# EAGLE design jamma (EAGLE 7.3.0)
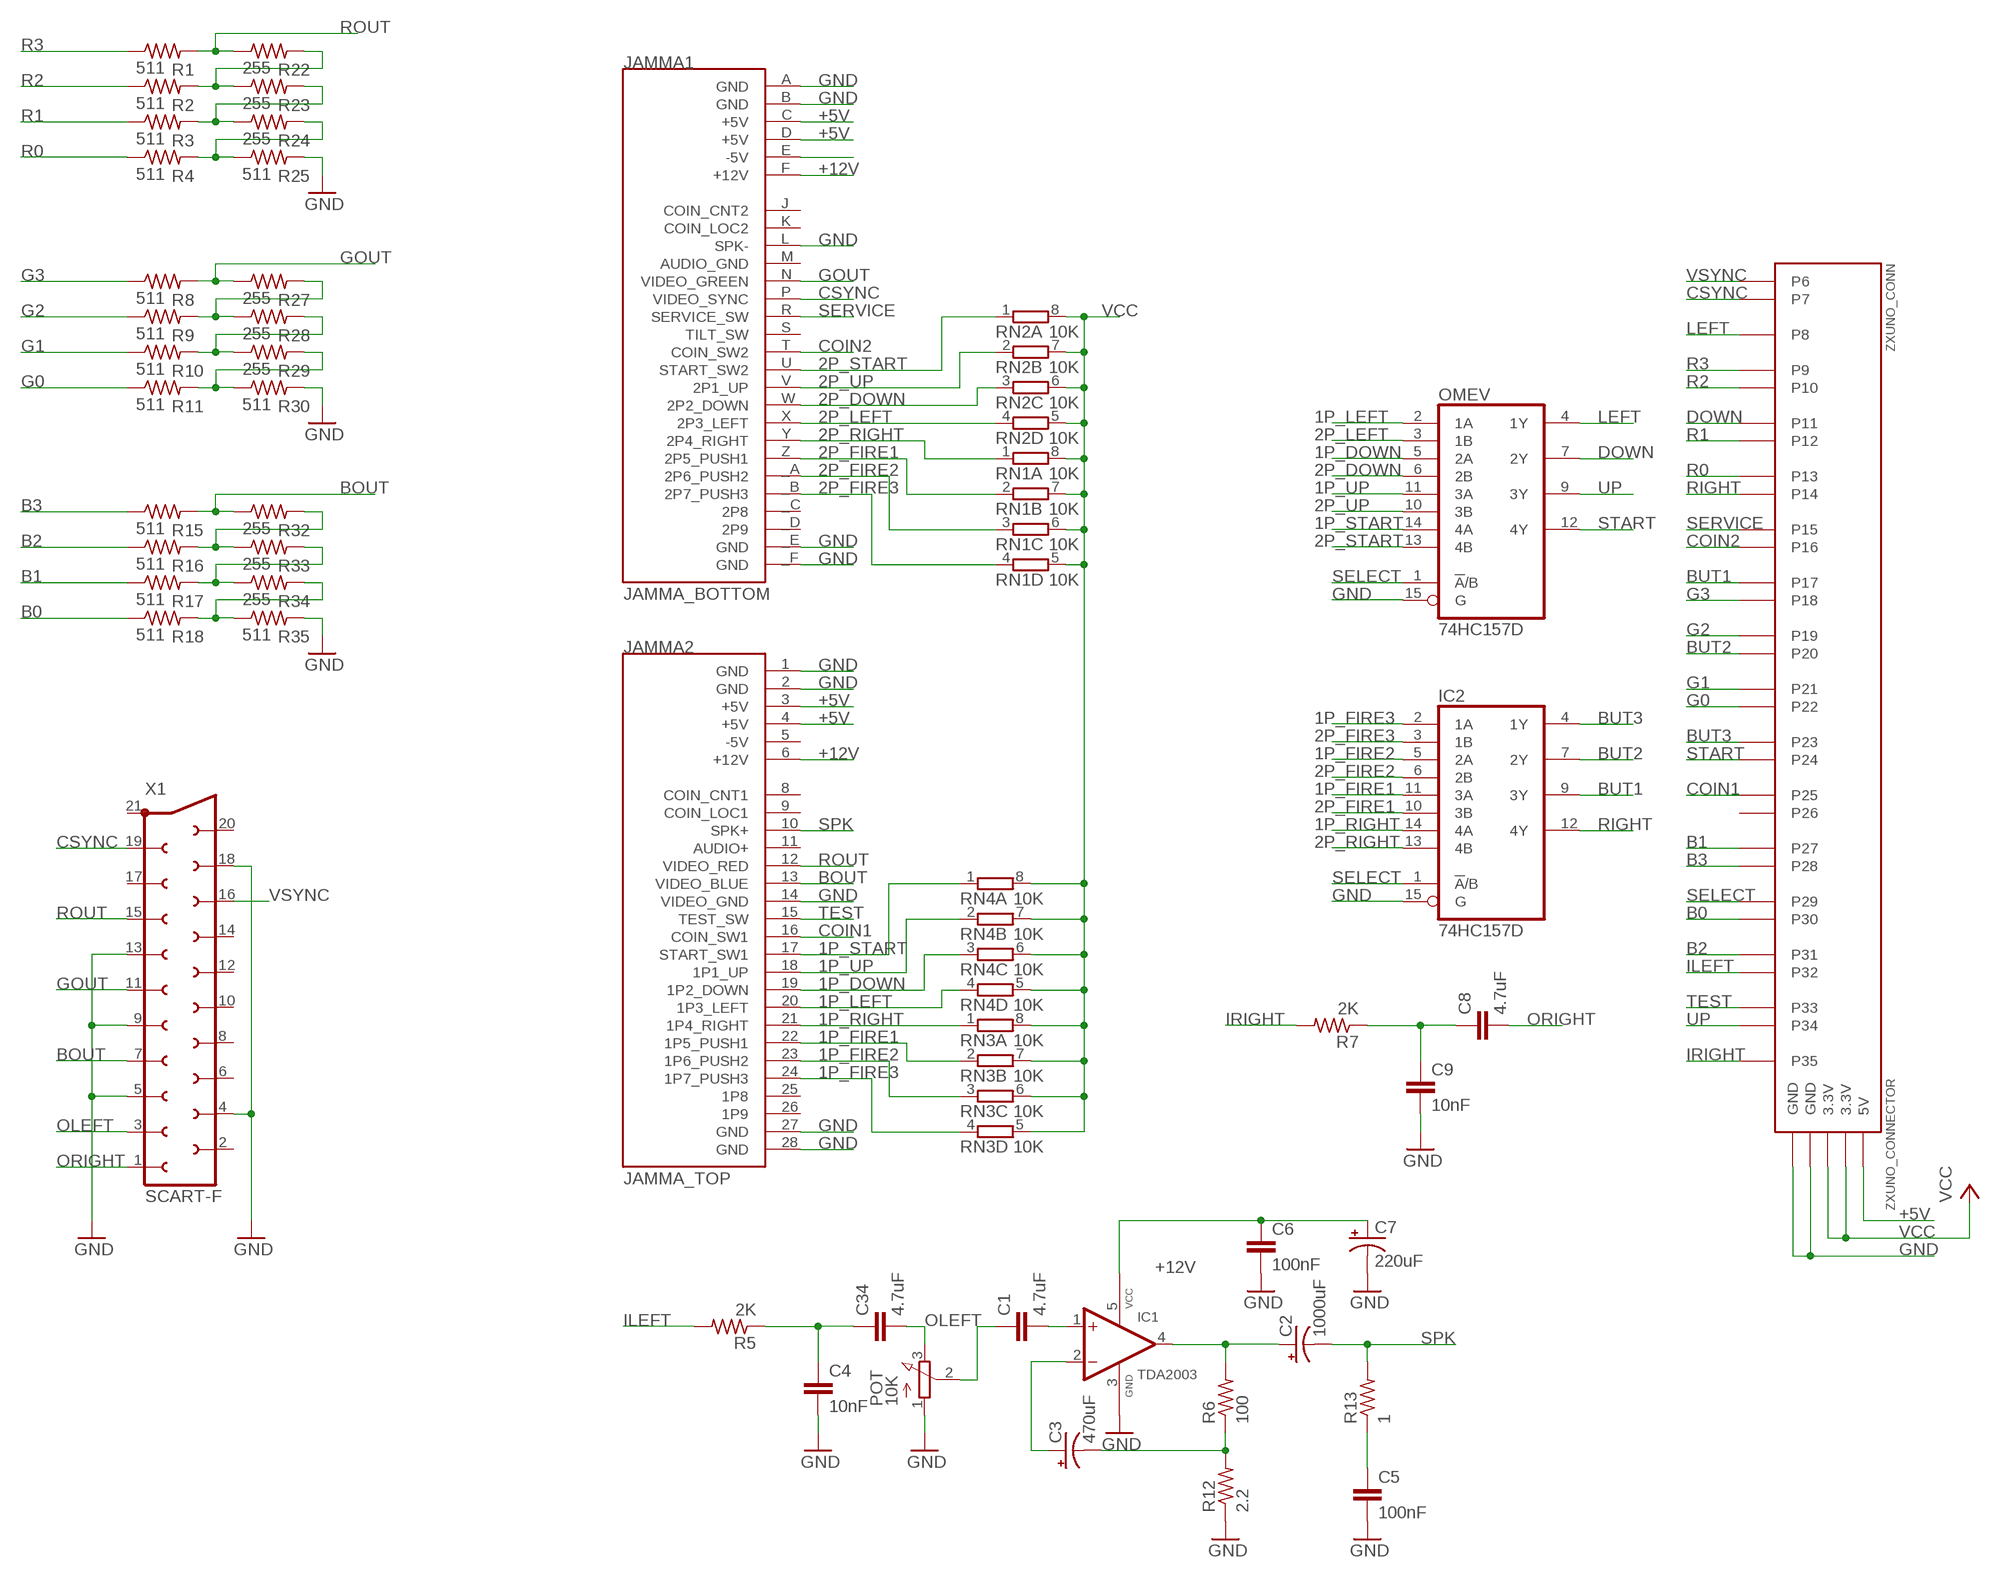
[diagram p0: schematic, sheet 1]

## Parts
C1  4.7uF  C-EUC0805  [C0805]
C2  1000uF  CPOL-USE5-13  [E5-13]
C3  470uF  CPOL-USE5-10.5  [E5-10,5]
C4  10nF  C-EUC0805  [C0805]
C5  100nF  C-EUC0805K  [C0805K]
C6  100nF  C-EUC0805K  [C0805K]
C7  220uF  CPOL-USE5-10.5  [E5-10,5]
C8  4.7uF  C-EUC0805  [C0805]
C9  10nF  C-EUC0805  [C0805]
C34  4.7uF  C-EUC0805  [C0805]
IC1  TDA2003  [PENTAWATT-V]
IC2  74HC157D  [SO16]
JAMMA1  JAMMA_BOTTOM  [JAMMA_BOTTOM]
JAMMA2  JAMMA_TOP  [JAMMA_TOP]
OMEV  74HC157D  [SO16]
POT  10K  POT  [POT]
R1  511  R-US_R0805  [R0805]
R2  511  R-US_R0805  [R0805]
R3  511  R-US_R0805  [R0805]
R4  511  R-US_R0805  [R0805]
R5  2K  R-US_M0805  [M0805]
R6  100  R-US_R0805  [R0805]
R7  2K  R-US_M0805  [M0805]
R8  511  R-US_R0805  [R0805]
R9  511  R-US_R0805  [R0805]
R10  511  R-US_R0805  [R0805]
R11  511  R-US_R0805  [R0805]
R12  2.2  R-US_R0805  [R0805]
R13  1  R-US_R0805  [R0805]
R15  511  R-US_R0805  [R0805]
R16  511  R-US_R0805  [R0805]
R17  511  R-US_R0805  [R0805]
R18  511  R-US_R0805  [R0805]
R22  255  R-US_R0805  [R0805]
R23  255  R-US_R0805  [R0805]
R24  255  R-US_R0805  [R0805]
R25  511  R-US_R0805  [R0805]
R27  255  R-US_R0805  [R0805]
R28  255  R-US_R0805  [R0805]
R29  255  R-US_R0805  [R0805]
R30  511  R-US_R0805  [R0805]
R32  255  R-US_R0805  [R0805]
R33  255  R-US_R0805  [R0805]
R34  255  R-US_R0805  [R0805]
R35  511  R-US_R0805  [R0805]
RN1  10K  4R-N0603-ARC  [0603-ARC]
RN2  10K  4R-N0603-ARC  [0603-ARC]
RN3  10K  4R-N0603-ARC  [0603-ARC]
RN4  10K  4R-N0603-ARC  [0603-ARC]
X1  SCART-F  [SCART-F]
ZXUNO_CONN  ZXUNO_CONNECTOR  [ZXUNO_CONNECTOR]

## Nets
1P_DOWN: JAMMA2.19(1P2_DOWN) OMEV.5(2A) RN4.3
1P_FIRE1: IC2.11(3A) JAMMA2.22(1P5_PUSH1) RN3.2
1P_FIRE2: IC2.5(2A) JAMMA2.23(1P6_PUSH2) RN3.3
1P_FIRE3: IC2.2(1A) JAMMA2.24(1P7_PUSH3) RN3.4
1P_LEFT: JAMMA2.20(1P3_LEFT) OMEV.2(1A) RN4.4
1P_RIGHT: IC2.14(4A) JAMMA2.21(1P4_RIGHT) RN3.1
1P_START: JAMMA2.17(START_SW1) OMEV.14(4A) RN4.1
1P_UP: JAMMA2.18(1P1_UP) OMEV.11(3A) RN4.2
2P_DOWN: JAMMA1.W(2P2_DOWN) OMEV.6(2B) RN2.3
2P_FIRE1: IC2.10(3B) JAMMA1.Z(2P5_PUSH1) RN1.2
2P_FIRE2: IC2.6(2B) JAMMA1._A(2P6_PUSH2) RN1.3
2P_FIRE3: IC2.3(1B) JAMMA1._B(2P7_PUSH3) RN1.4
2P_LEFT: JAMMA1.X(2P3_LEFT) OMEV.3(1B) RN2.4
2P_RIGHT: IC2.13(4B) JAMMA1.Y(2P4_RIGHT) RN1.1
2P_START: JAMMA1.U(START_SW2) OMEV.13(4B) RN2.1
2P_UP: JAMMA1.V(2P1_UP) OMEV.10(3B) RN2.2
+5V [power]: JAMMA1.C(+5V) JAMMA1.D(+5V) JAMMA2.3(+5V) JAMMA2.4(+5V) ZXUNO_CONN.5V
+12V: C6.1 C7.+ IC1.5(VCC) JAMMA1.F(+12V) JAMMA2.6(+12V)
B0: R18.1 ZXUNO_CONN.P30
B1: R17.1 ZXUNO_CONN.P27
B2: R16.1 ZXUNO_CONN.P31
B3: R15.1 ZXUNO_CONN.P28
BOUT: JAMMA2.13(VIDEO_BLUE) R15.2 R32.1 X1.7
BUT1: IC2.9(3Y) ZXUNO_CONN.P17
BUT2: IC2.7(2Y) ZXUNO_CONN.P20
BUT3: IC2.4(1Y) ZXUNO_CONN.P23
COIN1: JAMMA2.16(COIN_SW1) ZXUNO_CONN.P25
COIN2: JAMMA1.T(COIN_SW2) ZXUNO_CONN.P16
CSYNC: JAMMA1.P(VIDEO_SYNC) X1.19 ZXUNO_CONN.P7
DOWN: OMEV.7(2Y) ZXUNO_CONN.P11
G0: R11.1 ZXUNO_CONN.P22
G1: R10.1 ZXUNO_CONN.P21
G2: R9.1 ZXUNO_CONN.P19
G3: R8.1 ZXUNO_CONN.P18
GND [power]: C4.2 C5.2 C6.2 C7.- C9.2 IC1.3(GND) IC2.15(G) JAMMA1._E(GND) JAMMA1._F(GND) JAMMA1.A(GND) JAMMA1.B(GND) JAMMA1.L(SPK-) JAMMA2.1(GND) JAMMA2.2(GND) JAMMA2.14(VIDEO_GND) JAMMA2.27(GND) JAMMA2.28(GND) OMEV.15(G) POT.1(A) R12.1 R25.2 R30.2 R35.2 X1.4 X1.5 X1.9 X1.13 X1.18 ZXUNO_CONN.GND@1(GND) ZXUNO_CONN.GND@2(GND)
GOUT: JAMMA1.N(VIDEO_GREEN) R8.2 R27.1 X1.11
ILEFT: R5.2 ZXUNO_CONN.P32
IRIGHT: R7.2 ZXUNO_CONN.P35
LEFT: OMEV.4(1Y) ZXUNO_CONN.P8
N$1: C8.1 C9.1 R7.1
N$3: C1.2 IC1.1(+IN)
N$4: C1.1 POT.2(S)
N$5: C3.+ IC1.2(-IN)
N$6: JAMMA1.E(-5V)
N$7: C3.- R6.1 R12.2
N$8: R9.2 R27.2 R28.1
N$9: C2.+ IC1.4(OUT) R6.2
N$11: C4.1 C34.1 R5.1
N$12: C5.1 R13.1
N$15: R2.2 R22.2 R23.1
N$19: R3.2 R23.2 R24.1
N$21: R4.2 R24.2 R25.1
N$25: R11.2 R29.2 R30.1
N$27: R10.2 R28.2 R29.1
N$42: R16.2 R32.2 R33.1
N$43: R17.2 R33.2 R34.1
N$44: R18.2 R34.2 R35.1
OLEFT: C34.2 POT.3(E) X1.3
ORIGHT: C8.2 X1.1
R0: R4.1 ZXUNO_CONN.P13
R1: R3.1 ZXUNO_CONN.P12
R2: R2.1 ZXUNO_CONN.P10
R3: R1.1 ZXUNO_CONN.P9
RIGHT: IC2.12(4Y) ZXUNO_CONN.P14
ROUT: JAMMA2.12(VIDEO_RED) R1.2 R22.1 X1.15
SELECT: IC2.1(!A!/B) OMEV.1(!A!/B) ZXUNO_CONN.P29
SERVICE: JAMMA1.R(SERVICE_SW) ZXUNO_CONN.P15
SPK: C2.- JAMMA2.10(SPK+) R13.2
START: OMEV.12(4Y) ZXUNO_CONN.P24
TEST: JAMMA2.15(TEST_SW) ZXUNO_CONN.P33
UP: OMEV.9(3Y) ZXUNO_CONN.P34
VCC: RN1.5 RN1.6 RN1.7 RN1.8 RN2.5 RN2.6 RN2.7 RN2.8 RN3.5 RN3.6 RN3.7 RN3.8 RN4.5 RN4.6 RN4.7 RN4.8 ZXUNO_CONN.3.3V@1(3.3V) ZXUNO_CONN.3.3V@2(3.3V)
VSYNC: X1.16 ZXUNO_CONN.P6
Unconnected: JAMMA1._C(2P8) JAMMA1._D(2P9) JAMMA1.J(COIN_CNT2) JAMMA1.K(COIN_LOC2) JAMMA1.M(AUDIO_GND) JAMMA1.S(TILT_SW) JAMMA2.8(COIN_CNT1) JAMMA2.9(COIN_LOC1) JAMMA2.11(AUDIO+) JAMMA2.25(1P8) JAMMA2.26(1P9) X1.2 X1.6 X1.8 X1.10 X1.12 X1.14 X1.17 X1.20 X1.21 ZXUNO_CONN.P26

## Power pins joined to a net without a drawn wire
-5V: JAMMA2.5(-5V)
GND: IC2.8(GND) OMEV.8(GND)
VCC: IC2.16(VCC) OMEV.16(VCC)

## Library data of the parts
C1 C4-C6 C8 C9 C34 = rcl:C-EU: CAPACITOR, European symbol
C2 C3 C7 = rcl:CPOL-US: POLARIZED CAPACITOR, American symbol
IC1 = tda2003:TDA2003: Car Radio Audio Amplifier
IC2 OMEV = 74xx-eu:74*157: Quadruple 2-line to 1-line data SELECTOR/MULTIPLEXER
JAMMA1 = JAMMA:JAMMA_BOTTOM: JAMMA Connector Bottom Solder side for these card-edge connenctors HIROSE CR7E-56DA-3.96E HIROSE CR7E-56DB-3.96E KEL 1168-056-009
JAMMA2 = JAMMA:JAMMA_TOP: JAMMA Connector Top Parts side for these card-edge connenctors HIROSE CR7E-56DA-3.96E HIROSE CR7E-56DB-3.96E KEL 1168-056-009
POT = tda2003:POT
R1-R13 R15-R18 R22-R25 R27-R30 R32-R35 = rcl:R-US_: RESISTOR, American symbol
RN1-RN4 = resistor-dil:4R-N: Array Chip Resistor Source: RS Component / Phycomp; OC_FARNELL: unknown; OC_NEWARK: unknown
X1 = con-hirschmann:SCART-F: TV SCART CONNECTOR; OC_FARNELL: unknown; OC_NEWARK: unknown
ZXUNO_CONN = zxuno:ZXUNO_CONNECTOR

## Net classes
0 default: clearance 0.205 mm
1 power: width 0.305 mm, clearance 0.178 mm to class 0, clearance 0.229 mm

## Board
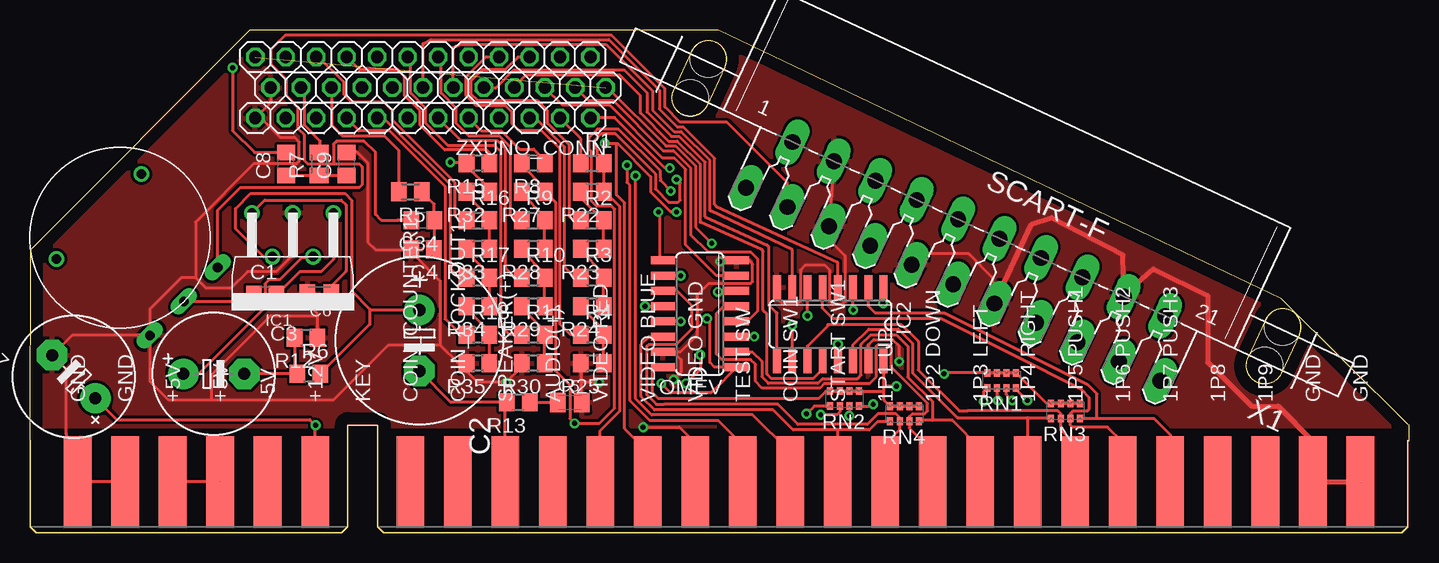
[diagram p1: board, top side]
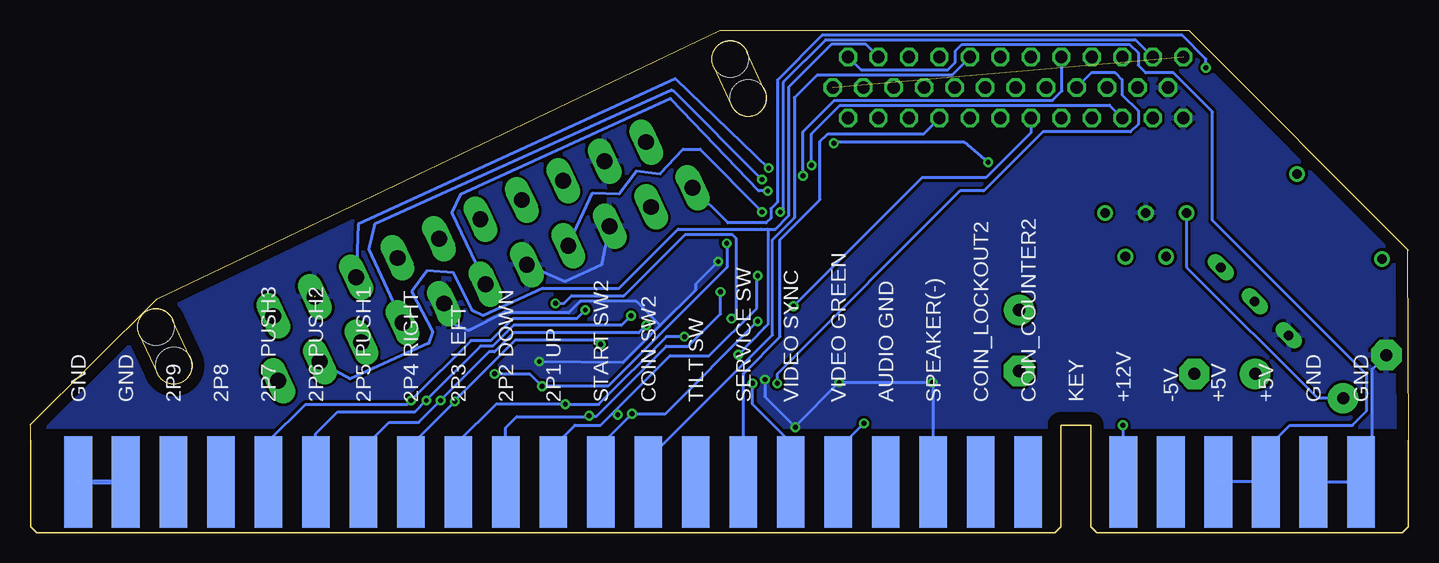
[diagram p2: board, bottom side, seen from below]

Size 114.92 x 41.89 mm. Coordinates in mm from the lower left corner, seen from the top.
Outline: 114.9,8.99 104.3,19.5 57.39,41.89 18.33,41.88 0.02,23.54
Outline: 0,7.61 0.06,23.54
Outline: 114.92,8.98 114.92,7.63
Copper layers (1*16): Top 0.035mm / dielectric 1.5mm / Bottom 0.035mm
Design rules "default": minimum track width 10mil, minimum drill 24mil, track to track 8mil, track to pad 8mil, pad to pad 8mil, via to via 8mil, smd to smd 8mil, copper to edge 40mil, drill to drill 8mil, minimum pad ring 10mil, minimum via ring 8mil, stop-mask expansion 4mil, vias tented up to drill 0mil, thermal gap 10mil

### Footprints (pad centres in the part's own frame; a part is rotated, then mirrored left to right if it is on the bottom)
C0805 = smd 1.3 x 1.5: 1 -0.95,0; 2 0.95,0
E5-13 = drill 1.016 pad 2.54: + -2.54,0 | drill 1.016 pad 2.54 octagon: - 2.54,0
E5-10,5 = drill 1.016 pad 2.54: + -2.54,0 | drill 1.016 pad 2.54 octagon: - 2.54,0
C0805K = smd 1.3 x 1.6: 1 -1,0; 2 1,0
PENTAWATT-V = drill 0.8: 1 -3.4,-3.81; 2 -1.7,-0.16; 3 0,-3.81; 4 1.7,-0.16; 5 3.4,-3.81
SO16 = smd 0.66 x 2.032: 1 -4.445,-3.073; 2 -3.175,-3.073; 3 -1.905,-3.073; 4 -0.635,-3.073; 5 0.635,-3.073; 6 1.905,-3.073; 7 3.175,-3.073; 8 4.445,-3.073; 9 4.445,3.073; 10 3.175,3.073; 11 1.905,3.073; 12 0.635,3.073; 13 -0.635,3.073; 14 -1.905,3.073; 15 -3.175,3.073; 16 -4.445,3.073
JAMMA_BOTTOM = smd 2.3 x 7.62 bottom: _A 33.66,-1.27; _B 37.62,-1.27; _C 41.58,-1.27; _D 45.54,-1.27; _E 49.5,-1.27; _F 53.46,-1.27; A -53.46,-1.27; B -49.5,-1.27; C -45.54,-1.27; D -41.58,-1.27; E -37.62,-1.27; F -33.66,-1.27; J -25.74,-1.27; K -21.78,-1.27; L -17.82,-1.27; M -13.86,-1.27; N -9.9,-1.27; P -5.94,-1.27; R -1.98,-1.27; S 1.98,-1.27; T 5.94,-1.27; U 9.9,-1.27; V 13.86,-1.27; W 17.82,-1.27; X 21.78,-1.27; Y 25.74,-1.27; Z 29.7,-1.27
JAMMA_TOP = smd 2.3 x 7.62: 1 -53.46,-1.27; 2 -49.5,-1.27; 3 -45.54,-1.27; 4 -41.58,-1.27; 5 -37.62,-1.27; 6 -33.66,-1.27; 8 -25.74,-1.27; 9 -21.78,-1.27; 10 -17.82,-1.27; 11 -13.86,-1.27; 12 -9.9,-1.27; 13 -5.94,-1.27; 14 -1.98,-1.27; 15 1.98,-1.27; 16 5.94,-1.27; 17 9.9,-1.27; 18 13.86,-1.27; 19 17.82,-1.27; 20 21.78,-1.27; 21 25.74,-1.27; 22 29.7,-1.27; 23 33.66,-1.27; 24 37.62,-1.27; 25 41.58,-1.27; 26 45.54,-1.27; 27 49.5,-1.27; 28 53.46,-1.27
POT = drill 0.8 long: 1 -4,0; 2 0,0; 3 4,0 | drill 0.8: P$4 -5,10; P$5 5,10
R0805 = smd 1.3 x 1.5: 1 -0.95,0; 2 0.95,0
M0805 = smd 1.3 x 1.6: 1 -0.95,0; 2 0.95,0
0603-ARC = smd 0.5 x 0.65: 1 -1.2,-0.625; 2 -0.4,-0.625; 3 0.4,-0.625; 4 1.2,-0.625; 5 1.2,0.625; 6 0.4,0.625; 7 -0.4,0.625; 8 -1.2,0.625
SCART-F = drill 1.321 long: 1 19.05,5.08; 2 17.145,0; 3 15.24,5.08; 4 13.335,0; 5 11.43,5.08; 6 9.525,0; 7 7.62,5.08; 8 5.715,0; 9 3.81,5.08; 10 1.905,0; 11 0,5.08; 12 -1.905,0; 13 -3.81,5.08; 14 -5.715,0; 15 -7.62,5.08; 16 -9.525,0; 17 -11.43,5.08; 18 -13.335,0; 19 -15.24,5.08; 20 -17.145,0; 21 -19.05,5.08 | hole 3.023: 26.416,0.254; 26.416,-3.302; -26.416,0.254; -26.416,-3.302
ZXUNO_CONNECTOR = drill 1.016 octagon: 3.3V@1 -13.97,0; 3.3V@2 15.24,-2.54; 5V -12.7,-2.54; GND@1 15.24,2.54; GND@2 13.97,0; NC@1 12.7,2.54; P6 -12.7,2.54; P7 -10.16,-2.54; P8 -11.43,0; P9 -10.16,2.54; P10 -7.62,-2.54; P11 -8.89,0; P12 -7.62,2.54; P13 -5.08,-2.54; P14 -6.35,0; P15 -5.08,2.54; P16 -2.54,-2.54; P17 -3.81,0; P18 -2.54,2.54; P19 0,-2.54; P20 -1.27,0; P21 0,2.54; P22 2.54,-2.54; P23 1.27,0; P24 2.54,2.54; P25 5.08,-2.54; P26 3.81,0; P27 5.08,2.54; P28 7.62,-2.54; P29 6.35,0; P30 7.62,2.54; P31 10.16,-2.54; P32 8.89,0; P33 10.16,2.54; P34 12.7,-2.54; P35 11.43,0

### Placement (x,y rotation side)
C1  19.6,19.82 0 top
C2  32.46,16.01 270 top
C3  15.32,13.23 0 top
C4  32.73,23.63 180 top
C5  45,10.85 0 top
C6  24.13,19.9 180 top
C7  3.65,13 135 top
C8  21.34,30.73 90 top
C9  26.42,30.73 90 top
C34  32.74,26.02 180 top
IC1  21.9,22.84 180 top
IC2  66.72,17.37 180 top
JAMMA1  57.44,5.5 0 top
JAMMA2  57.44,5.5 0 top
OMEV  55.84,18.24 90 top
POT  12.82,19.27 45 top
R1  46.87,30.78 0 top
R2  46.87,26.02 0 top
R3  46.87,21.26 0 top
R4  46.87,16.49 0 top
R5  31.71,28.4 180 top
R6  23.25,13.23 0 top
R7  24.11,30.73 90 top
R8  41.95,30.78 180 top
R9  41.95,26.02 0 top
R10  41.95,21.26 0 top
R11  41.95,16.49 0 top
R12  23.01,16.25 180 top
R13  40.72,10.85 180 top
R15  37.35,30.78 180 top
R16  37.35,26.02 0 top
R17  37.35,21.26 0 top
R18  37.35,16.49 0 top
R22  46.87,28.4 180 top
R23  46.87,23.64 180 top
R24  46.87,18.88 180 top
R25  46.87,14.11 180 top
R27  41.95,28.4 180 top
R28  41.95,23.64 180 top
R29  41.95,18.88 180 top
R30  41.95,14.11 180 top
R32  37.35,28.4 180 top
R33  37.35,23.64 180 top
R34  37.35,18.88 180 top
R35  37.35,14.11 180 top
RN1  81,12.68 0 top
RN2  67.91,11.18 0 top
RN3  86.32,10.14 0 top
RN4  72.91,9.91 0 top
X1  79.1,25.31 155 top
ZXUNO_CONN  34.02,37.09 180 top

### Tracks (layer width: path | path; a pad name or v marks a point on that pad's centre or on a via)
1P_DOWN
  Top 0.254: JAMMA2.19 75.26,6.76 73.31,8.71 RN4.3 73.31,9.67 73.54,9.91 74.58,9.91 74.81,10.14 74.81,10.78 71.75,13.84 71.75,15.54 71.59,15.69 70.72,15.69 70.56,15.54 70.56,13 70.01,12.45 66.24,12.45 65.84,12.05 61.03,12.05 60.48,12.6 60.48,14.03 60.08,14.42 57.7,14.42 57.23,14.9 57.23,18.27 57.83,18.88 OMEV.5
1P_FIRE1
  Top 0.254: JAMMA2.22 87.14,7.35 85.93,8.56 RN3.2 85.92,9.91 85.69,10.14 78.15,10.14 78.14,10.14 77.47,10.14 74.05,13.55 74.05,15.93 72.62,17.36 66.51,17.36 66.51,17.24 64.81,15.54 IC2.11
1P_FIRE2
  Top 0.254: JAMMA2.23 91.1,7.51 89.82,8.8 86.88,8.8 86.72,8.95 RN3.3 86.72,9.91 86.96,10.14 88.15,10.14 88.31,10.3 88.31,11.26 87.67,11.89 75.92,17.84 66.96,17.84 66.08,18.72 IC2.5
1P_FIRE3
  Top 0.254: JAMMA2.24 95.05,5.5 95.05,8.16 93.69,9.52 RN3.4 88.93,9.52 88.94,9.51 88.94,11.57 88.15,12.37 76.24,18.32 70.45,18.32 69.89,18.88 IC2.2
1P_LEFT
  Top 0.254: JAMMA2.20 79.22,7.01 76.88,9.35 75.21,9.35 | 75.21,9.35 74.18,9.35 RN4.4 | OMEV.2 60.21,15.07 61,14.27 61,13 61.56,12.45 65.69,12.45 66.08,12.84 68.98,12.84 69.29,13.15 69.29,15.69 70.08,16.49 72.23,16.49 73.18,15.54 73.18,12.97 75.21,10.94 75.21,9.35
1P_RIGHT
  Top 0.254: IC2.14 68.62,15.38 68.62,15.66 69.93,16.96 72.39,16.96 73.58,15.77 73.58,13.31 77.31,9.58 77.31,9.59 83.15,9.59 | 83.15,9.59 85.05,9.59 RN3.1 | JAMMA2.21 83.18,9.56 83.15,9.59
1P_START
  Top 0.254: JAMMA2.17 67.34,8.49 67.27,8.56 | RN4.1 70.69,9.27 69.97,8.56 67.27,8.56 | 67.27,8.56 63.62,8.56 61.95,10.22 52.06,10.22 50.96,11.33 50.96,15.69 51.59,16.33 OMEV.14
1P_UP
  Top 0.254: JAMMA2.18 71.24,5.55 71.24,7.37 72.51,8.63 RN4.2 72.51,9.59 72.19,9.91 70.69,9.91 69.81,9.03 64.02,9.03 62.35,10.7 52.85,10.7 52.85,10.69 52.23,10.69 51.43,11.49 51.43,15.54 51.59,15.69 53.89,15.69 55.16,16.96 55.16,18.95 53.89,20.22 52.84,20.22 OMEV.11
2P_DOWN  (via drill 0.4)
  Top 0.254: RN2.3 v68.31,9.75 v68.3,9.75 | OMEV.6 57.43,20.15 v57.35,20.07
  Bottom 0.254: JAMMA1.W 75.26,8.75 74.34,9.67 68.38,9.67 v68.3,9.75 68.23,9.67 67.75,9.67 61.88,15.54 60.05,15.54 57.35,18.24 v57.35,20.07
2P_FIRE1  (via drill 0.4)
  Top 0.254: RN1.2 80.6,11.1 v80.69,11.02 | IC2.10 63.54,15.94 v63.54,17.29
  Bottom 0.254: JAMMA1.Z 87.14,7.03 84.97,9.19 82.51,9.19 v80.69,11.02 76.65,15.06 76.2,15.06 74.6,16.65 64.18,16.65 v63.54,17.29
2P_FIRE2  (via drill 0.4)
  Top 0.254: RN1.3 81.4,11.49 v81.88,11.02 | v64.81,18.08 IC2.6
  Bottom 0.254: JAMMA1._A 91.1,8.23 89.26,10.07 82.83,10.07 v81.88,11.02 77.36,15.54 76.36,15.54 74.61,17.28 65.61,17.28 v64.81,18.08
2P_FIRE3  (via drill 0.4)
  Top 0.254: v68.62,18.56 IC2.3 | RN1.4 82.2,11.96 v83.15,11.02
  Bottom 0.254: JAMMA1._B 95.06,7.6 91.96,10.7 83.47,10.7 v83.15,11.02 78.15,16.01 76.51,16.01 74.69,17.84 69.34,17.84 v68.62,18.56
2P_LEFT  (via drill 0.4)
  Top 0.254: v60.37,16.34 OMEV.3 | RN2.4 70.14,10.55 v70.29,10.7
  Bottom 0.254: JAMMA1.X 79.22,7.57 76.08,10.7 v70.29,10.7 67.51,10.7 61.88,16.34 v60.37,16.34
2P_RIGHT  (via drill 0.4)
  Top 0.254: RN1.1 79.5,11.75 v79.5,10.94 | v67.35,15.7 IC2.13
  Bottom 0.254: JAMMA1.Y 83.18,7.26 v79.5,10.94 79.5,11.02 74.5,16.02 67.67,16.02 v67.35,15.7
2P_START  (via drill 0.4)
  Top 0.254: v54.26,17.61 OMEV.13 | v64.73,9.91 65.38,10.55 RN2.1
  Bottom 0.254: JAMMA1.U 67.34,7.3 v64.73,9.91 61.95,9.91 v54.26,17.61
2P_UP  (via drill 0.4)
  Top 0.254: v54.26,21.42 OMEV.10 | RN2.2 67.51,10.06 67.27,9.83 v65.92,9.83
  Bottom 0.254: JAMMA1.V 71.3,7.15 69.5,8.95 67.35,8.95 66.16,10.14 | 66.16,10.14 61.56,14.75 58.3,14.75 54.33,18.72 54.33,21.34 v54.26,21.42 | v65.92,9.83 65.92,9.91 66.16,10.14
+5V  (1 unrouted)
  Top 0.254: JAMMA1.D JAMMA1.C
  Bottom 0.254: JAMMA1.D JAMMA1.C 11.9,6.97 9.92,8.95 4.68,8.95 3.49,10.14 3.49,13.15 16.35,26.01 16.35,35.06 19.6,38.32 21.9,38.32 22.54,38.95 22.54,39.98 23.25,40.7 37.22,40.7 37.78,40.14 37.78,39.19 38.41,38.55 45.64,38.55 ZXUNO_CONN.5V
+12V  (via drill 0.4)
  Top 0.254: JAMMA1.F 23.78,8.87 23.81,8.9 v23.81,8.95 23.33,9.42 7.22,9.42 C7.+ | 25.4,19.63 C6.1 25.13,20.58 26.34,21.79 26.34,27.32 25.94,27.71 19.57,27.71 IC1.5 18.53,26.65
  Bottom 0.254: JAMMA1.F 23.78,8.95 v23.81,8.95 | C7.+ 5.49,11.25 7.62,11.25 18.5,22.14 IC1.5
B0
  Top 0.254: R18.1 35.92,16.49 34.6,17.81 34.6,28.87 30,33.47 27.43,33.47 26.39,34.51 26.44,34.51 ZXUNO_CONN.P30
B1
  Top 0.254: R17.1 35.76,21.26 35.05,21.97 35,22.02 35,29.03 29.48,34.55 ZXUNO_CONN.P27
B2
  Top 0.254: R16.1 35.84,26.02 35.4,26.46 35.4,29.19 30.24,34.35 30.24,35.14 29.52,35.86 26.83,35.86 26.19,36.49 26.19,37.52 24.08,39.63 ZXUNO_CONN.P31
B3
  Top 0.254: R15.1 38.3,31.66 38.06,31.89 34.57,31.89 32.51,33.96 32.51,35.15 31.24,36.42 31.24,38.01 30.68,38.56 27.47,38.56 ZXUNO_CONN.P28
BOUT  (via drill 0.4)
  Top 0.254: R32.1 38.3,28.64 36.4,30.54 R15.2 36.32,30.86 v35.05,30.86 | v47.91,32.45 48.81,32.45 | 48.81,32.45 48.96,32.45 51.75,29.66 51.75,28.39 53.42,26.73 v53.89,26.73 | 48.81,32.45 48.89,32.37 48.89,28.16 49.57,27.48 49.57,8.66 51.5,6.74 JAMMA2.13
  Bottom 0.254: v35.05,30.86 37.02,32.52 47.83,32.52 v47.91,32.45 | X1.7 68.02,28.32 65.8,28.24 64.37,30.14 62.39,29.9 60.48,31.97 59.05,31.97 v53.89,26.73
BUT1
  Top 0.254: IC2.9 62.27,18.32 62.22,18.32 61.59,18.95 61.59,23.84 61.48,23.96 56.27,26.33 56.27,30.87 | ZXUNO_CONN.P17 38.86,37.09 40.32,38.55 49.53,38.55 51.42,36.66 51.42,35.08 53.46,33.03 54.12,33.03 56.27,30.87 | 56.27,30.87
BUT2
  Top 0.254: IC2.7 63.54,23.56 56.72,26.81 56.67,26.86 56.67,31.03 | ZXUNO_CONN.P20 35.29,40.43 35.95,40.7 48.02,40.7 51.91,36.81 51.91,35.22 53.7,33.43 54.28,33.43 56.67,31.03 | 56.67,31.03
BUT3
  Top 0.254: IC2.4 67.35,22.53 57.19,27.21 57.07,27.34 57.07,31.19 54.43,33.82 53.94,33.82 52.46,35.3 52.46,36.89 48.26,41.09 33.41,41.09 32.75,40.75 ZXUNO_CONN.P23
COIN1  (via drill 0.4)
  Top 0.254: JAMMA2.16 63.38,6.69 60.24,9.82 51.83,9.82 50.48,11.17 v50.48,29.74
  Bottom 0.254: v50.48,29.74 50.48,33.4 47.86,36.01 29.68,36.01 28.89,36.81 28.89,39.58 ZXUNO_CONN.P25
COIN2
  Bottom 0.254: JAMMA1.T 63.38,6.77 62.74,6.77 53.02,16.49 53.02,24.43 51.19,26.25 51.19,36.25 49.29,38.16 38.03,38.16 ZXUNO_CONN.P16
CSYNC  (via drill 0.4)
  Top 0.254: v55.88,14.82 55.88,13.63 v54.69,12.44
  Bottom 0.254: ZXUNO_CONN.P7 45.24,40.7 48.1,40.7 51.67,37.13 51.67,26.41 52.78,25.3 53.4,25.3 | 53.42,17.36 53.69,17.08 | 53.69,17.08 v55.88,14.82 | JAMMA1.P 51.51,5.51 51.51,7.52 54.69,10.69 v54.69,12.44 | X1.19 90.76,14.23 88.18,12.84 81.67,15.77 81.36,16.73 83.1,20.06 81.83,21.81 79.61,21.65 78.02,18.47 77.15,18.08 72.15,20.38 65.8,20.38 60.88,25.3 53.97,25.3 53.4,25.3 | 53.69,17.08 53.42,17.35 53.42,25.29 53.4,25.3
DOWN
  Top 0.254: OMEV.7 57.75,21.42 57.22,21.42 54.65,23.98 54.65,30.27 53.72,31.2 52.75,31.2 48.34,35.62 44.38,35.62 ZXUNO_CONN.P11
G0
  Top 0.254: R11.1 39.97,16.49 39.25,17.21 39.25,31.73 38.7,32.29 34.81,32.29 32.98,34.12 32.98,35.39 31.71,36.66 31.71,39.4 ZXUNO_CONN.P22
G1
  Top 0.254: R10.1 40.44,21.26 39.65,22.05 39.65,31.97 38.94,32.69 35.88,32.69 ZXUNO_CONN.P21
G2
  Top 0.254: R9.1 40.52,26.02 40.05,26.5 40.05,32.13 39.09,33.08 36.55,33.08 35.52,34.12 35.52,35.39 34.25,36.66 34.25,39.4 ZXUNO_CONN.P19
G3
  Top 0.254: ZXUNO_CONN.P18 36.56,34.53 37.62,33.47 39.29,33.47 40.8,31.97 41.99,31.97 42.62,31.33 42.62,31.06 R8.1
GND  (via drill 0.4)  (2 unrouted)
  Top 0.254: X1.9 74.43,23.24 78.25,23.24 80.24,21.25 80.24,19.25 X1.13 | 23.97,18.08 23.97,18.24 23.17,19.03 23.17,19.85 C6.2 | POT.1 9.99,12.6 11.51,11.09 15.16,11.09 | 15.16,11.09 15.16,13.15 20.08,18.08 23.97,18.08 | 34.21,15.62 34.21,20.96 31.78,23.39 C4.2 | 34.21,15.62 35.72,14.11 R35.2 36.43,14.08 36.43,13.39 37.3,12.52 v39.68,12.52 41,13.84 R30.2 | R12.1 23.97,18.08 | 13.81,21.25 14.68,20.38 16.74,20.38 18.13,21.76 20.54,21.76 21.9,23.12 IC1.3 | 13.81,21.25 12.62,21.25 10,18.63 POT.1 | ZXUNO_CONN.GND@1 | ZXUNO_CONN.GND@2 20.05,35.82 ZXUNO_CONN.GND@1 | POT.1 3.5,16.44 C7.- 3.02,13.62 3.02,8.3 JAMMA1.A 3.97,5.49 3.97,5.46 4.01,4.23 JAMMA1.B | R25.2 45.92,12.52 | 45.92,12.52 45.92,10.93 C5.2 | 34.21,15.62 29.84,15.62 25.32,11.09 15.16,11.09 | IC2.8 62.23,20.4 62.23,19.58 62.78,19.03 63.89,19.03 64.21,19.35 64.21,21.89 64.61,22.28 66.27,22.28 66.67,21.89 66.67,19.27 66.91,19.03 67.7,19.03 67.94,19.27 67.94,23.08 66.59,24.42 X1.5 X1.4 | IC2.15 69.89,15.66 70.32,16.09 71.91,16.09 72.47,15.54 v72.47,14.27 | v57.54,22.6 58.83,22.6 OMEV.8 59.92,22.68 60.24,22.36 60.24,20.93 60.08,20.77 56.59,20.77 55.64,19.82 55.64,16.49 54.22,15.07 OMEV.15 53.65,15.07 54.29,14.42 54.29,13.39 v53.65,12.76 | v51.11,8.79 54.13,8.79 55.4,7.52 55.4,5.56 JAMMA2.14 | v47.46,12.52 45.92,12.52 | 13.81,21.25 13.79,21.26 13.79,25.89 18.64,30.73 22.21,30.73 22.45,30.97 22.45,32.55 22.05,32.95 20.86,32.95 19.26,34.55 ZXUNO_CONN.GND@1 | C4.2 31.78,23.77 | C9.2 27.21,31.76 28.16,30.81 28.16,24.22 28.8,23.58 31.74,23.58 C4.2
  Top 0.406: JAMMA2.27 JAMMA2.28 | JAMMA2.27 106.99,6.01 | 91.12,19.74 93.66,21.97 98.18,19.74 98.18,14.19 101.83,10.54 104.06,10.54 106.91,7.68 106.91,5.52 JAMMA2.27 | X1.13 83.5,25.7 85.17,26.25 91.12,23.16 X1.18
  Bottom 0.254: JAMMA1.B JAMMA1.A 3.02,8.14 3.02,13.62 C7.- | JAMMA1.L 39.62,12.45 v39.68,12.52 v47.46,12.52 51.11,8.87 v51.11,8.79 53.65,11.33 v53.65,12.76 | X1.9 70.32,20.93 67.23,22.36 X1.5 | v72.47,14.27 65.48,14.19 62.39,17.28 | v57.54,22.6 59.45,20.7 59.45,20.22 62.39,17.28 | X1.13 79.53,17.36 78.34,16.89 75.32,18.39 75.24,18.31 70.01,18.31 69.05,19.27 64.37,19.27 62.39,17.28
  Bottom 0.406: JAMMA2.28 JAMMA2.27
  pour Bottom: 114.22,8.87 0.55,8.87 0.55,23.39 18.65,41.49 56.67,41.49 56.91,41.73 104.29,19.11 113.98,9.42 113.98,8.95
  pour Top: 114.22,8.87 0.55,8.87 0.55,23.39 18.65,41.49 56.67,41.49 56.91,41.73 104.29,19.11 113.98,9.42 113.98,8.95
GOUT  (via drill 0.4)
  Top 0.254: R8.2 41,30.62 42.9,28.72 R27.1 43.81,27.52 43.81,13.47 45,12.28 45,9.5 v45.4,9.11 47.46,9.11 48.73,10.38 48.73,26.97 48.49,27.2 47.22,27.2 46.83,27.6 46.83,31.73 46.59,31.97 46.59,32.92 47.3,33.63 49.05,33.63 52.54,30.14 52.54,29.59 52.54,29.35 v53.42,28.47
  Bottom 0.254: JAMMA1.N 47.54,5.51 47.54,6.96 v45.4,9.11 | X1.11 79.77,26.65 79.05,28.16 61.51,36.17 54.2,28.51 54.17,28.47 v53.42,28.47
ILEFT
  Top 0.254: ZXUNO_CONN.P32 25.13,33.98 26.03,33.08 29.52,33.08 30.71,31.89 30.71,28.45 R5.2
IRIGHT
  Top 0.254: ZXUNO_CONN.P35 22.84,36.84 22.84,33.98 24.19,32.64 24.19,31.76 R7.2
LEFT
  Top 0.254: OMEV.4 59.81,17.61 60.64,18.43 60.64,22.84 60.08,23.39 56.51,23.39 55.08,24.82 55.08,30.4 53.64,31.84 52.77,31.84 48.59,36.01 46.53,36.01 ZXUNO_CONN.P8
N$1
  Top 0.254: C9.1 R7.1 C8.1
N$3
  Top 0.254: IC1.1 25.3,22.79 24.27,21.76 22.49,21.76 C1.2
N$4
  Top 0.254: POT.2 18.1,19.27 C1.1
N$5
  Top 0.254: C3.+ 14.05,13.23 19.6,18.79 19.6,20.74 19.99,21.12 20.86,21.12 22.68,22.95 23.55,22.95 IC1.2
N$7
  Top 0.254: C3.- R6.1 22.07,13.47 R12.2
N$8
  Top 0.254: R27.2 41,28.24 42.9,26.34 R9.2 R28.1
N$9
  Top 0.254: 28.33,18.63 28.33,17.36 R6.2 | IC1.4 19.46,23 17.13,25.33 17.13,27 18.4,28.27 26.26,28.27 26.81,27.71 26.81,20.15 28.33,18.63 | C2.+ 28.41,18.55 28.33,18.63
N$11
  Top 0.254: R5.1 33.69,27.37 C34.1 33.69,25.82 C4.1
N$12
  Top 0.254: R13.1 C5.1
N$15
  Top 0.254: R23.1 R2.2 47.77,26.02 45.92,27.87 R22.2
N$19
  Top 0.254: R23.2 45.92,23.48 47.82,21.58 R3.2 R24.1
N$21
  Top 0.254: R24.2 45.92,18.79 47.82,16.89 R4.2 R25.1
N$25
  Top 0.254: R29.2 41,18.71 42.9,16.81 R11.2 R30.1
N$27
  Top 0.254: R28.2 41,23.48 42.9,21.58 R10.2 R29.1
N$42
  Top 0.254: R32.2 36.4,28.16 38.3,26.26 R16.2 R33.1
N$43
  Top 0.254: R33.2 36.71,23.32 36.71,23.08 38.3,21.5 R17.2 R34.1
N$44
  Top 0.254: R34.2 36.63,18.64 36.63,18.4 38.3,16.74 R18.2 R35.1
OLEFT
  Top 0.254: C34.2 30.71,26.02 30.65,26.02 30.62,26.05 29.27,26.05 28.8,26.52 28.8,31.68 27.84,32.63 25.54,32.63 25.3,32.4 25.3,30.73 | X1.3 63.14,29.17 58.09,34.22 54.2,34.22 52.93,35.49 52.93,37 48.48,41.44 21.26,41.44 20.07,40.25 20.07,39.06 21.34,37.79 21.34,36.44 22.37,35.41 22.37,33.67 22.84,33.19 22.84,31.05 23.16,30.73 25.3,30.73 | POT.3 15.65,26.87 17.53,28.74 27.45,28.74 27.69,28.98 27.69,30.49 27.45,30.73 25.3,30.73
ORIGHT  (via drill 0.4)
  Top 0.254: v16.89,38.75 v16.89,38.74 16.89,33.5 18.72,31.68 C8.2
  Bottom 0.254: v16.89,38.75 16.89,39.46 18.87,41.44 48.88,41.44 52.61,37.71 52.61,27.55 53.16,27 53.16,26.2 53.56,25.81 56.74,25.81 X1.1
R0
  Top 0.254: R4.1 45.05,16.49 44.17,17.37 44.17,31.97 42.67,33.48 40.79,33.48 40.16,34.11 40.16,35.06 39.6,35.62 37.14,35.62 36.35,36.41 36.35,38 37.98,39.63 ZXUNO_CONN.P13
R1
  Top 0.254: R3.1 45.44,21.26 44.57,22.13 44.57,32.13 42.15,34.55 ZXUNO_CONN.P12
R2
  Top 0.254: R2.1 45.29,26.02 44.97,26.34 44.97,32.29 43.14,34.12 43.1,34.16 43.1,35.22 42.3,36.01 37.3,36.01 36.75,36.57 36.75,37.6 37.7,38.55 39.6,38.55 40.68,39.63 ZXUNO_CONN.P10
R3
  Top 0.254: R1.1 45.92,32.81 ZXUNO_CONN.P9
RIGHT
  Top 0.254: IC2.12 66.08,13.64 65.29,12.84 61.8,12.84 61.56,13.08 61.56,13.11 61.43,13.23 61.43,18.23 61.12,18.55 61.12,23.45 61,23.56 55.88,25.85 55.88,30.7 53.94,32.63 53.23,32.63 50.88,34.98 50.88,36.41 49.13,38.16 41.35,38.16 40.37,37.18 ZXUNO_CONN.P14
ROUT  (via drill 0.4)
  Top 0.254: JAMMA2.12 47.54,8.51 49.18,10.14 49.18,27.16 47.93,28.4 R22.1 R1.2 47.82,31.05 47.3,31.57 47.3,31.89 47.07,32.13 47.07,32.68 47.62,33.24 48.81,33.24 52.15,29.9 52.15,28.65 | 52.15,28.65 53.24,27.55 54.04,27.55 54.2,27.71 54.2,29.12 v53.89,29.43 | 52.15,28.65
  Bottom 0.254: X1.15 86.67,23.63 86.2,25.7 61.43,36.89 61.27,36.81 v53.89,29.43
SELECT  (via drill 0.4)
  Top 0.254: v52.62,12.44 53.42,11.65 56.75,11.65 56.99,11.88 57.01,11.88 OMEV.1 57.06,13.8 56.67,14.19 56.67,17.6 v56.43,17.84 | IC2.1 71.16,19.15 v71.12,19.11
  Bottom 0.254: ZXUNO_CONN.P29 26.44,38.32 24.44,38.32 23.89,37.76 23.89,36.49 22.54,35.14 22.54,34.03 23.17,33.4 30.48,33.4 35.4,28.47 37.38,28.47 52.62,13.23 v52.62,12.44 | v71.12,19.11 70.4,19.11 69.77,19.74 65.4,19.74 60.32,24.82 56.35,24.82 56.04,24.51 56.04,18.23 v56.43,17.84
SERVICE
  Bottom 0.254: JAMMA1.R 55.46,13.26 52.38,16.33 52.38,24.43 49.05,27.76 49.05,32.6 48.42,33.24 40.41,33.24 ZXUNO_CONN.P15
SPK
  Top 0.254: JAMMA2.10 39.62,10.7 R13.2 35.08,10.85 C2.-
START  (via drill 0.4)
  Top 0.254: OMEV.12 v51.28,18.88 v51.27,18.87
  Bottom 0.254: ZXUNO_CONN.P24 31.48,33.34 35.24,29.59 40.56,29.59 v51.27,18.87
TEST  (via drill 0.4)
  Top 0.254: JAMMA2.15 59.42,7.31 57.38,9.34 51.67,9.34 50,11.01 50,28.95 49.76,29.19 v49.76,30.62
  Bottom 0.254: v49.76,30.62 49.76,33.24 47.38,35.62 24.93,35.62 ZXUNO_CONN.P33
UP  (via drill 0.4)
  Top 0.254: OMEV.9 52.54,22.69 52.54,26.58 v52.38,26.73
  Bottom 0.254: ZXUNO_CONN.P34 22.78,41.09 48.57,41.09 52.15,37.52 52.15,26.97 v52.38,26.73
VCC  (via drill 0.4)  (1 unrouted)
  Top 0.254: RN4.5 RN4.6 RN4.7 RN4.8 71.16,11.08 71.16,11.81 | RN3.5 RN3.6 RN3.7 RN3.8 84.74,10.77 RN1.5 RN1.6 RN1.7 RN1.8 76.19,13.31 v76.2,13.23 | v72.23,12.2 71.2,12.2 71.16,12.24 | IC2.16 71.16,12.24 | 71.16,12.24 71.16,11.81 | 71.16,11.81 71.16,11.8 RN2.5 RN2.6 RN2.7 RN2.8 66.35,11.8 65.72,11.17 52.38,11.17 51.91,11.65 51.91,13.55 52.15,13.79 OMEV.16 52.78,13.78 | v56.83,24.11 55.48,25.46 55.48,30.56 53.8,32.24 53.01,32.24 48.15,37.09 ZXUNO_CONN.3.3V@1
  Bottom 0.254: v76.2,13.23 73.26,13.23 v72.23,12.2 66.75,12.2 56.83,22.12 v56.83,24.11
VSYNC  (via drill 0.4)
  Top 0.254: ZXUNO_CONN.P6 46.76,34.59 48.73,34.59 52.94,30.38 v53.34,30.38
  Bottom 0.254: X1.16 87.55,25.7 61.12,37.84 v53.34,30.38